# Altium schematic sheet Debug.SchDoc: LEDs GPIO TPs
size A3; DrawnBy: Scott Camp and Finn Molloy; Address1: ECE Department; Address2: University of Canterbury; Address3: Christchurch 8041; Address4: New Zealand; Revision: 1
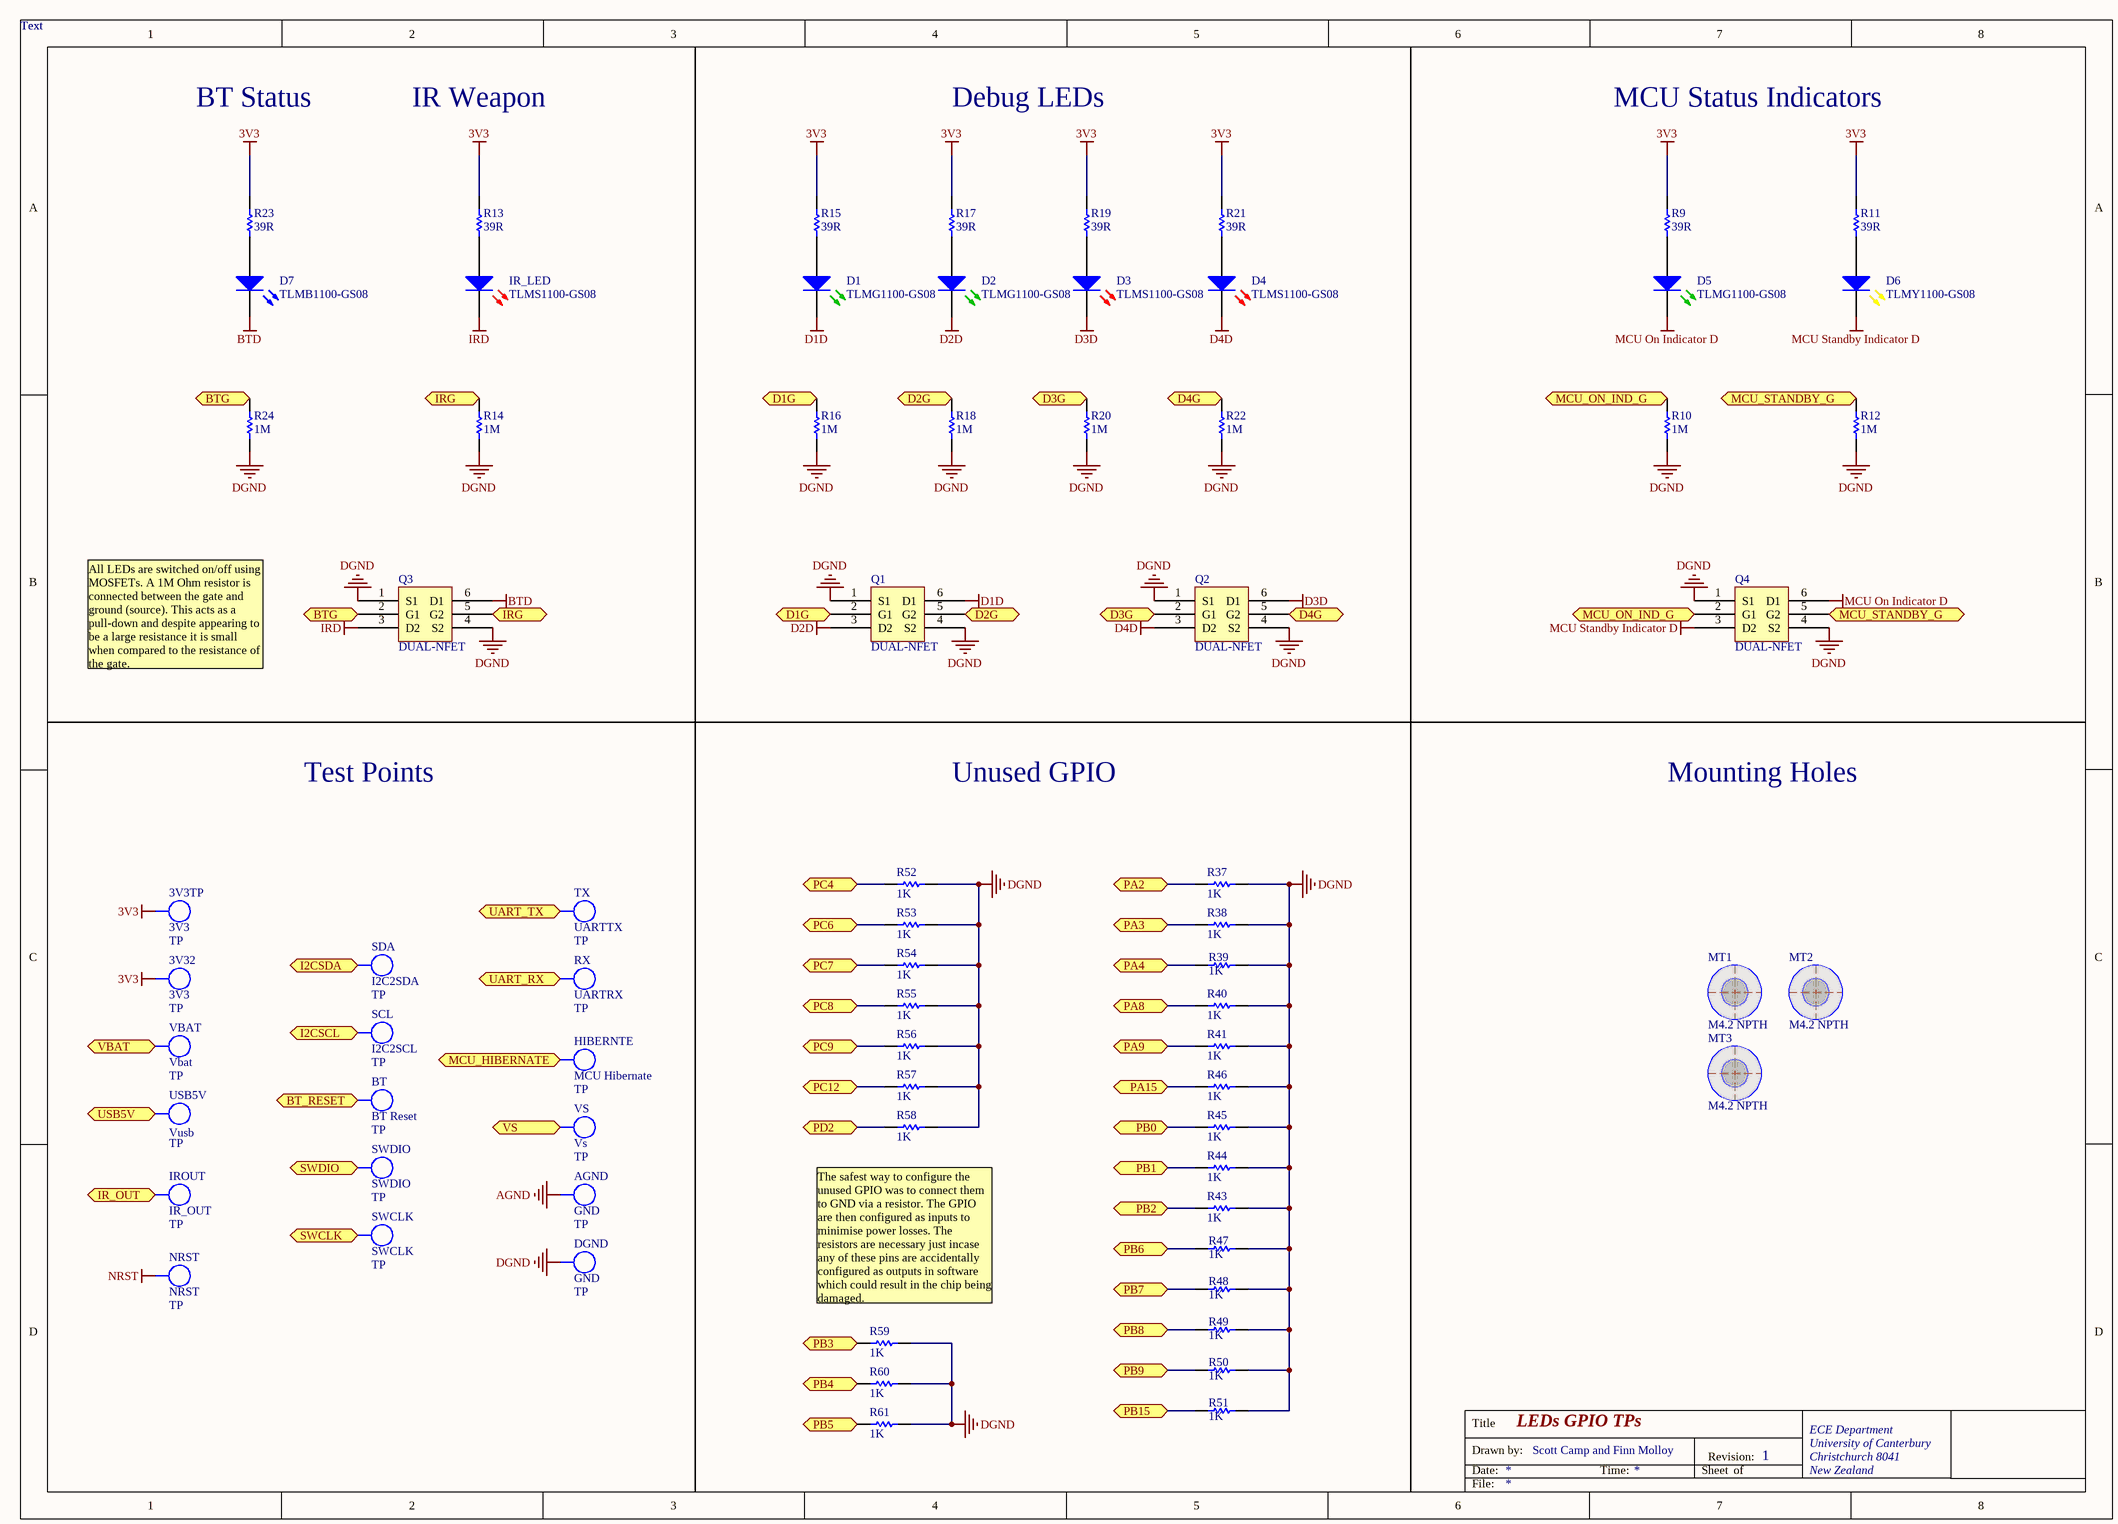
[diagram p0: Debug.SchDoc]

## Parts
3V3TP  3V3  value TP  [TEST_POINT_3.5X2MM]  (no BOM)
3V32  3V3  value TP  [TEST_POINT_3.5X2MM]  (no BOM)
AGND  GND  value TP  [TEST_POINT_3.5X2MM]  (no BOM)
BT  BT Reset  value TP  [TEST_POINT_3.5X2MM]  (no BOM)
D1  TLMG1100-GS08  [LED0.8X1.6]
D2  TLMG1100-GS08  [LED0.8X1.6]
D3  TLMS1100-GS08  [LED0.8X1.6]
D4  TLMS1100-GS08  [LED0.8X1.6]
D5  TLMG1100-GS08  [LED0.8X1.6]
D6  TLMY1100-GS08  [LED0.8X1.6]
D7  TLMB1100-GS08  [LED0.8X1.6]
DGND  GND  value TP  [TEST_POINT_3.5X2MM]  (no BOM)
HIBERNTE  MCU Hibernate  value TP  [TEST_POINT_3.5X2MM]  (no BOM)
IR_LED  TLMS1100-GS08  [LED0.8X1.6]
IROUT  IR_OUT  value TP  [TEST_POINT_3.5X2MM]  (no BOM)
MT1  M4.2 NPTH  [MNT-HOLE_4.2mm_NPTH]  (no BOM)
MT2  M4.2 NPTH  [MNT-HOLE_4.2mm_NPTH]  (no BOM)
MT3  M4.2 NPTH  [MNT-HOLE_4.2mm_NPTH]  (no BOM)
NRST  NRST  value TP  [TEST_POINT_3.5X2MM]  (no BOM)
Q1  DUAL-NFET  [SOT363-6N]
Q2  DUAL-NFET  [SOT363-6N]
Q3  DUAL-NFET  [SOT363-6N]
Q4  DUAL-NFET  [SOT363-6N]
R9  39R  [RESC1608L]
R10  1M  [RESC1608L]
R11  39R  [RESC1608L]
R12  1M  [RESC1608L]
R13  39R  [RESC1608L]
R14  1M  [RESC1608L]
R15  39R  [RESC1608L]
R16  1M  [RESC1608L]
R17  39R  [RESC1608L]
R18  1M  [RESC1608L]
R19  39R  [RESC1608L]
R20  1M  [RESC1608L]
R21  39R  [RESC1608L]
R22  1M  [RESC1608L]
R23  39R  [RESC1608L]
R24  1M  [RESC1608L]
R37  1K  [RESC1608L]
R38  1K  [RESC1608L]
R39  1K  [RESC1608L]
R40  1K  [RESC1608L]
R41  1K  [RESC1608L]
R43  1K  [RESC1608L]
R44  1K  [RESC1608L]
R45  1K  [RESC1608L]
R46  1K  [RESC1608L]
R47  1K  [RESC1608L]
R48  1K  [RESC1608L]
R49  1K  [RESC1608L]
R50  1K  [RESC1608L]
R51  1K  [RESC1608L]
R52  1K  [RESC1608L]
R53  1K  [RESC1608L]
R54  1K  [RESC1608L]
R55  1K  [RESC1608L]
R56  1K  [RESC1608L]
R57  1K  [RESC1608L]
R58  1K  [RESC1608L]
R59  1K  [RESC1608L]
R60  1K  [RESC1608L]
R61  1K  [RESC1608L]
RX  UARTRX  value TP  [TEST_POINT_3.5X2MM]  (no BOM)
SCL  I2C2SCL  value TP  [TEST_POINT_3.5X2MM]  (no BOM)
SDA  I2C2SDA  value TP  [TEST_POINT_3.5X2MM]  (no BOM)
SWCLK  SWCLK  value TP  [TEST_POINT_3.5X2MM]  (no BOM)
SWDIO  SWDIO  value TP  [TEST_POINT_3.5X2MM]  (no BOM)
TX  UARTTX  value TP  [TEST_POINT_3.5X2MM]  (no BOM)
USB5V  Vusb  value TP  [TEST_POINT_3.5X2MM]  (no BOM)
VBAT  Vbat  value TP  [TEST_POINT_3.5X2MM]  (no BOM)
VS  Vs  value TP  [TEST_POINT_3.5X2MM]  (no BOM)

## Ports
BT_RESET (bidir), BTG (bidir), D1G (bidir), D2G (bidir), D3G (bidir), D4G (bidir), I2CSCL (bidir), I2CSDA (bidir), IR_OUT (bidir), IRG (bidir), MCU_HIBERNATE (bidir), MCU_ON_IND_G (bidir), MCU_STANDBY_G (bidir), PA2 (bidir), PA3 (bidir), PA4 (bidir), PA8 (bidir), PA9 (bidir), PA15 (bidir), PB0 (bidir), PB1 (bidir), PB2 (bidir), PB3 (bidir), PB4 (bidir), PB5 (bidir), PB6 (bidir), PB7 (bidir), PB8 (bidir), PB9 (bidir), PB15 (bidir), PC4 (bidir), PC6 (bidir), PC7 (bidir), PC8 (bidir), PC9 (bidir), PC12 (bidir), PD2 (bidir), SWCLK (bidir), SWDIO (bidir), UART_RX (bidir), UART_TX (bidir), USB5V (bidir), VBAT (bidir), VS (bidir)

## Nets
3V3: 3V3TP.1 3V32.1 R9.2 R11.2 R13.2 R15.2 R17.2 R19.2 R21.2 R23.2
AGND: AGND.1
BTD: D7.2(K) Q3.6(D1)
D1D: D1.2(K) Q1.6(D1)
D2D: D2.2(K) Q1.3(D2)
D3D: D3.2(K) Q2.6(D1)
D4D: D4.2(K) Q2.3(D2)
DGND: DGND.1 Q1.1(S1) Q1.4(S2) Q2.1(S1) Q2.4(S2) Q3.1(S1) Q3.4(S2) Q4.1(S1) Q4.4(S2) R10.1 R12.1 R14.1 R16.1 R18.1 R20.1 R22.1 R24.1 R37.1 R38.1 R39.1 R40.1 R41.1 R43.1 R44.1 R45.1 R46.1 R47.2 R48.2 R49.2 R50.2 R51.1 R52.1 R53.1 R54.1 R55.1 R56.1 R57.1 R58.1 R59.1 R60.1 R61.1
IRD: IR_LED.2(K) Q3.3(D2)
MCU On Indicator D: D5.2(K) Q4.6(D1)
MCU Standby Indicator D: D6.2(K) Q4.3(D2)
NRST: NRST.1
BT_RESET: BT.1 ; port BT_RESET
BTG: Q3.2(G1) R24.2 ; port BTG
D1G: Q1.2(G1) R16.2 ; port D1G
D2G: Q1.5(G2) R18.2 ; port D2G
D3G: Q2.2(G1) R20.2 ; port D3G
D4G: Q2.5(G2) R22.2 ; port D4G
I2CSCL: SCL.1 ; port I2CSCL
I2CSDA: SDA.1 ; port I2CSDA
IR_OUT: IROUT.1 ; port IR_OUT
IRG: Q3.5(G2) R14.2 ; port IRG
MCU_HIBERNATE: HIBERNTE.1 ; port MCU_HIBERNATE
MCU_ON_IND_G: Q4.2(G1) R10.2 ; port MCU_ON_IND_G
MCU_STANDBY_G: Q4.5(G2) R12.2 ; port MCU_STANDBY_G
PA2: R37.2 ; port PA2
PA3: R38.2 ; port PA3
PA4: R39.2 ; port PA4
PA8: R40.2 ; port PA8
PA9: R41.2 ; port PA9
PA15: R46.2 ; port PA15
PB0: R45.2 ; port PB0
PB1: R44.2 ; port PB1
PB2: R43.2 ; port PB2
PB3: R59.2 ; port PB3
PB4: R60.2 ; port PB4
PB5: R61.2 ; port PB5
PB6: R47.1 ; port PB6
PB7: R48.1 ; port PB7
PB8: R49.1 ; port PB8
PB9: R50.1 ; port PB9
PB15: R51.2 ; port PB15
PC4: R52.2 ; port PC4
PC6: R53.2 ; port PC6
PC7: R54.2 ; port PC7
PC8: R55.2 ; port PC8
PC9: R56.2 ; port PC9
PC12: R57.2 ; port PC12
PD2: R58.2 ; port PD2
SWCLK: SWCLK.1 ; port SWCLK
SWDIO: SWDIO.1 ; port SWDIO
UART_RX: RX.1 ; port UART_RX
UART_TX: TX.1 ; port UART_TX
USB5V: USB5V.1 ; port USB5V
VBAT: VBAT.1 ; port VBAT
VS: VS.1 ; port VS
NetD1_1: D1.1(A) R15.1
NetD2_1: D2.1(A) R17.1
NetD3_1: D3.1(A) R19.1
NetD4_1: D4.1(A) R21.1
NetD5_1: D5.1(A) R9.1
NetD6_1: D6.1(A) R11.1
NetD7_1: D7.1(A) R23.1
NetIR_LED_1: IR_LED.1(A) R13.1

## Notes on the sheet
- Text
- BT Status
- IR Weapon
- Debug LEDs
- MCU Status Indicators
- All LEDs are switched on/off using MOSFETs. A 1M Ohm resistor is connected between the gate and ground (source). This acts as a pull-down and despite appearing to be a large resistance it is small when compared to the resistance of the gate.
- Test Points
- Unused GPIO
- Mounting Holes
- The safest way to configure the unused GPIO was to connect them to GND via a resistor. The GPIO are then configured as inputs to minimise power losses. The resistors are necessary just incase any of these pins are accidentally configured as outputs in software which could result in the chip being damaged.
- Title
- Drawn by:
- Date:
- Time:
- Sheet
- Revision:
- of
- File:

## Library data of the parts
3V3TP 3V32 AGND BT DGND HIBERNTE IROUT NRST RX SCL SDA SWCLK SWDIO TX USB5V VBAT VS = TP_TESTPOINT: Test-Point SMD; Manufacturer PN: *; Manufacturer: *; Supplier 1: ECE Stock; Supplier Part Number 1: 5016KTR-ND; Storage Location: ProtoPlace
D1 D2 D5 = DL_TLMG1100: LED Green 0603; Manufacturer: Vishay Semiconductor Opto Division; Millicandela Rating: 35mcd; Voltage - Forward (Vf) Typ: 2.1V; Viewing Angle: 160°; Wavelength - Peak: 572nm; Supplier 1: Farnell; Supplier 2: Digi-Key; Color: Green; Package / Case: 0603 (1608 Metric); Packaging: Cut Tape (CT); Size / Dimension: 1.60mm L x 0.80mm W; Pricing: 1=0.67, 10=0.525, 25=0.4376, 100=0.359, 250=0.29912, 500=0.24852, 1000=0.18408 (NZD); Supplier Part Number 1: 2293494; Supplier Part Number 2: 751-1165-1-ND; Manufacturer Part Number: TLMG1100-GS08
D3 D4 IR_LED = DL_TLMS1100: LED Red 0603; Lens Style/Size: Rectangle with Flat Top, 1.6mm x 0.8mm; Millicandela Rating: 63mcd; Viewing Angle: 160°; Voltage - Forward (Vf) Typ: 2.1V; Wavelength - Dominant: 633nm; Supplier 1: Farnell; Supplier 2: Digi-Key; Package / Case: 0603 (1608 Metric); Size / Dimension: 1.60mm L x 0.80mm W; Pricing: 1=0.67, 10=0.525, 25=0.4376, 100=0.359, 250=0.29912, 500=0.24852, 1000=0.18408 (NZD); Supplier Part Number 1: 1440338; Supplier Part Number 2: 751-1182-1-ND; Manufacturer Part Number: TLMS1100-GS08
D6 = DL_TLMY1100: LED Yellow 0603; Manufacturer: Vishay Semiconductor Opto Division; Lens Style/Size: Rectangle with Flat Top, 1.6mm x 0.8mm; Millicandela Rating: 80mcd; Viewing Angle: 160°; Voltage - Forward (Vf) Typ: 2.1V; Wavelength - Peak: 591nm; Supplier 1: Farnell; Supplier 2: Digi-Key; Package / Case: 0603 (1608 Metric); Packaging: Cut Tape (CT); Size / Dimension: 1.60mm L x 0.80mm W; Pricing: 1=0.67, 10=0.525, 25=0.4376, 100=0.359, 250=0.29912, 500=0.24852, 1000=0.18408 (NZD); Supplier Part Number 1: 2103887; Supplier Part Number 2: 751-1186-1-ND; Manufacturer Part Number: TLMY1100-GS08
D7 = DL_TLMB1100: LED Blue 0603; Manufacturer: Vishay Semiconductor Opto Division; Lens Style/Size: Rectangle with Flat Top, 1.6mm x 0.8mm; Millicandela Rating: 5mcd; Viewing Angle: 160°; Voltage - Forward (Vf) Typ: 3.9V; Wavelength - Peak: 428nm; Supplier 1: Farnell; Supplier 2: Digi-Key; Package / Case: 0603 (1608 Metric); Packaging: Cut Tape (CT); Size / Dimension: 1.60mm L x 0.80mm W; Pricing: 1=1.51, 10=1.341, 25=1.184, 100=1.0656, 250=0.92748, 500=0.82882, 1000=0.65121 (NZD); Supplier Part Number 1: 1328305; Supplier Part Number 2: 751-1156-1-ND; Manufacturer Part Number: TLMB1100-GS08
MT1-MT3 = MC_M4.2_HOLE_NPT: Fixing M4.2 Mount Hole NPTH; Manufacturer: Hi-Q; Manufacturer PN: 4NE Series M4 Clearance; price: 0; value: M4.2 NPTH
R9 R11 R13 R15 R17 R19 R21 R23 = RS_39R: RES 39 OHM 1/10W 5% 0603 SMD; Storage Location: ProtoPlace; Supplier: ECE Dept Stock; Value: 39R
R10 R12 R14 R16 R18 R20 R22 R24 = RS_1M: RES 1.0M OHM 1/10W 5% 0603 SMD; Storage Location: ProtoPlace  Red Pottel; Supplier: ECE Dept Stock; Value: 1M
R37-R41 R43-R61 = RS_1K: RES 1.0K OHM 1/10W 5% 0603 SMD; Storage Location: ProtoPlace; Supplier: ECE Dept Stock; Value: 1K